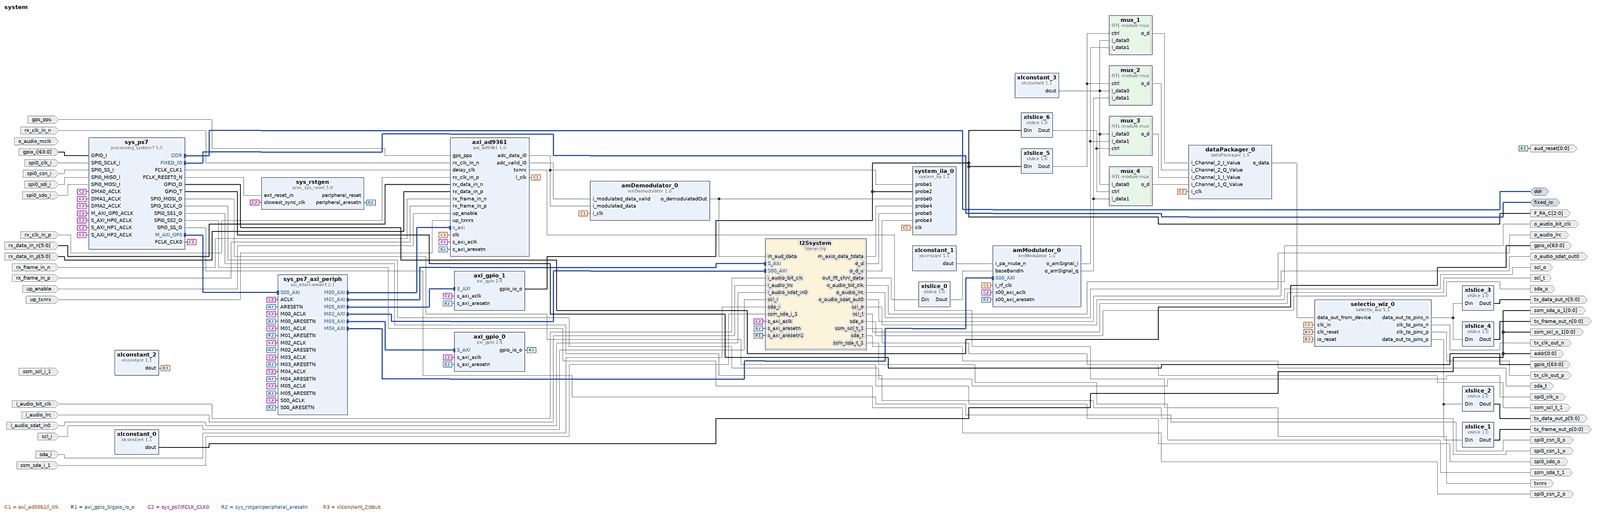
[diagram p0: block diagram of the top level, whole]
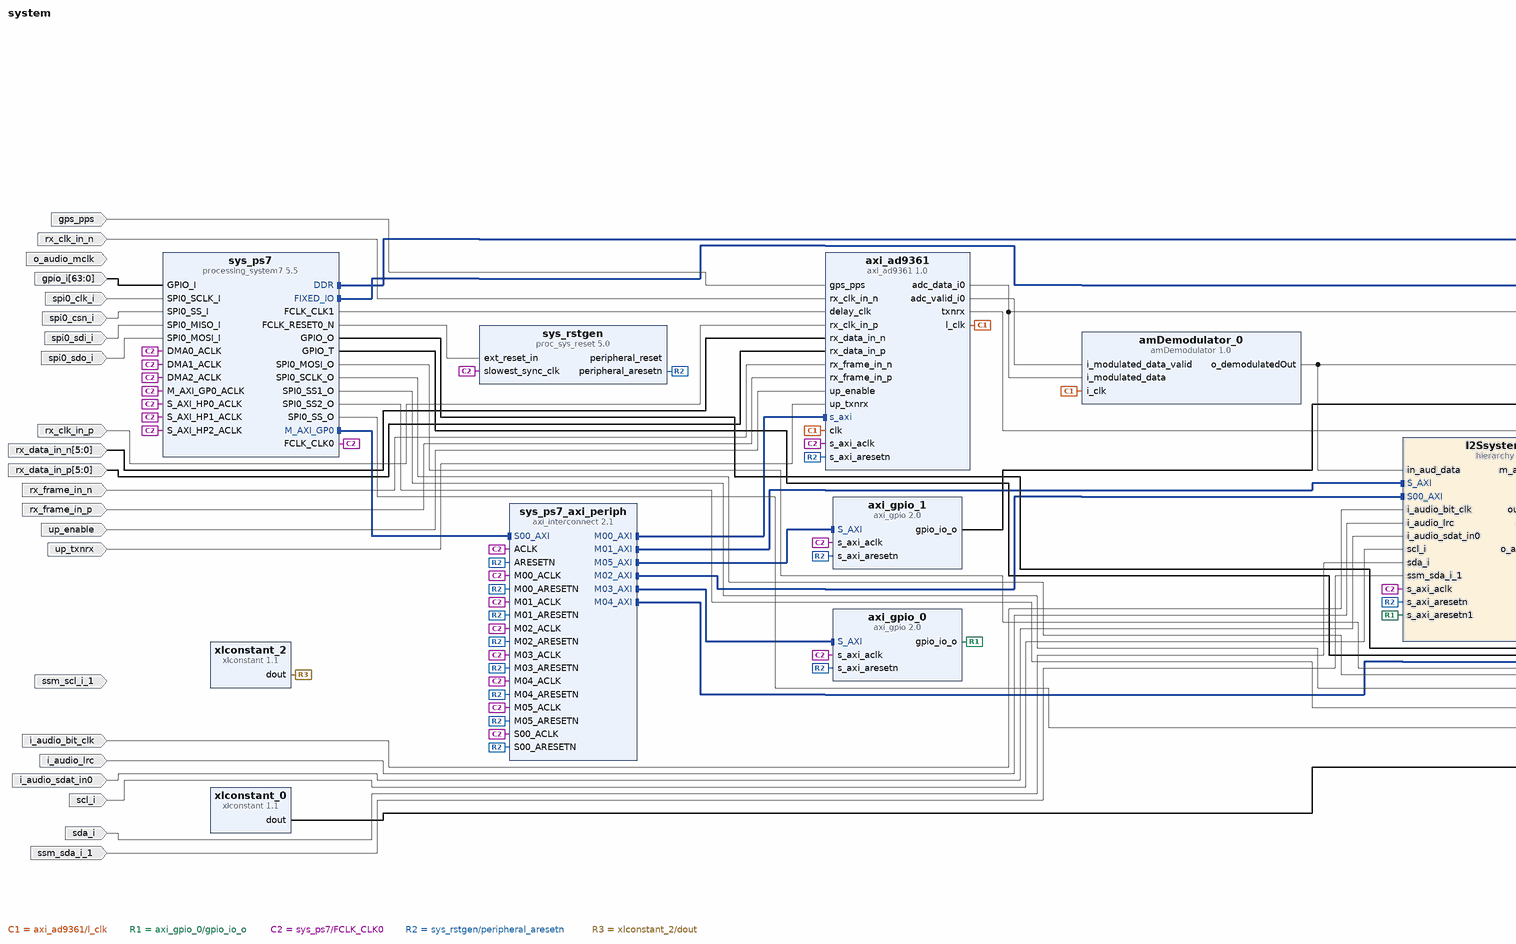
[diagram p1: block diagram of the top level, left part]
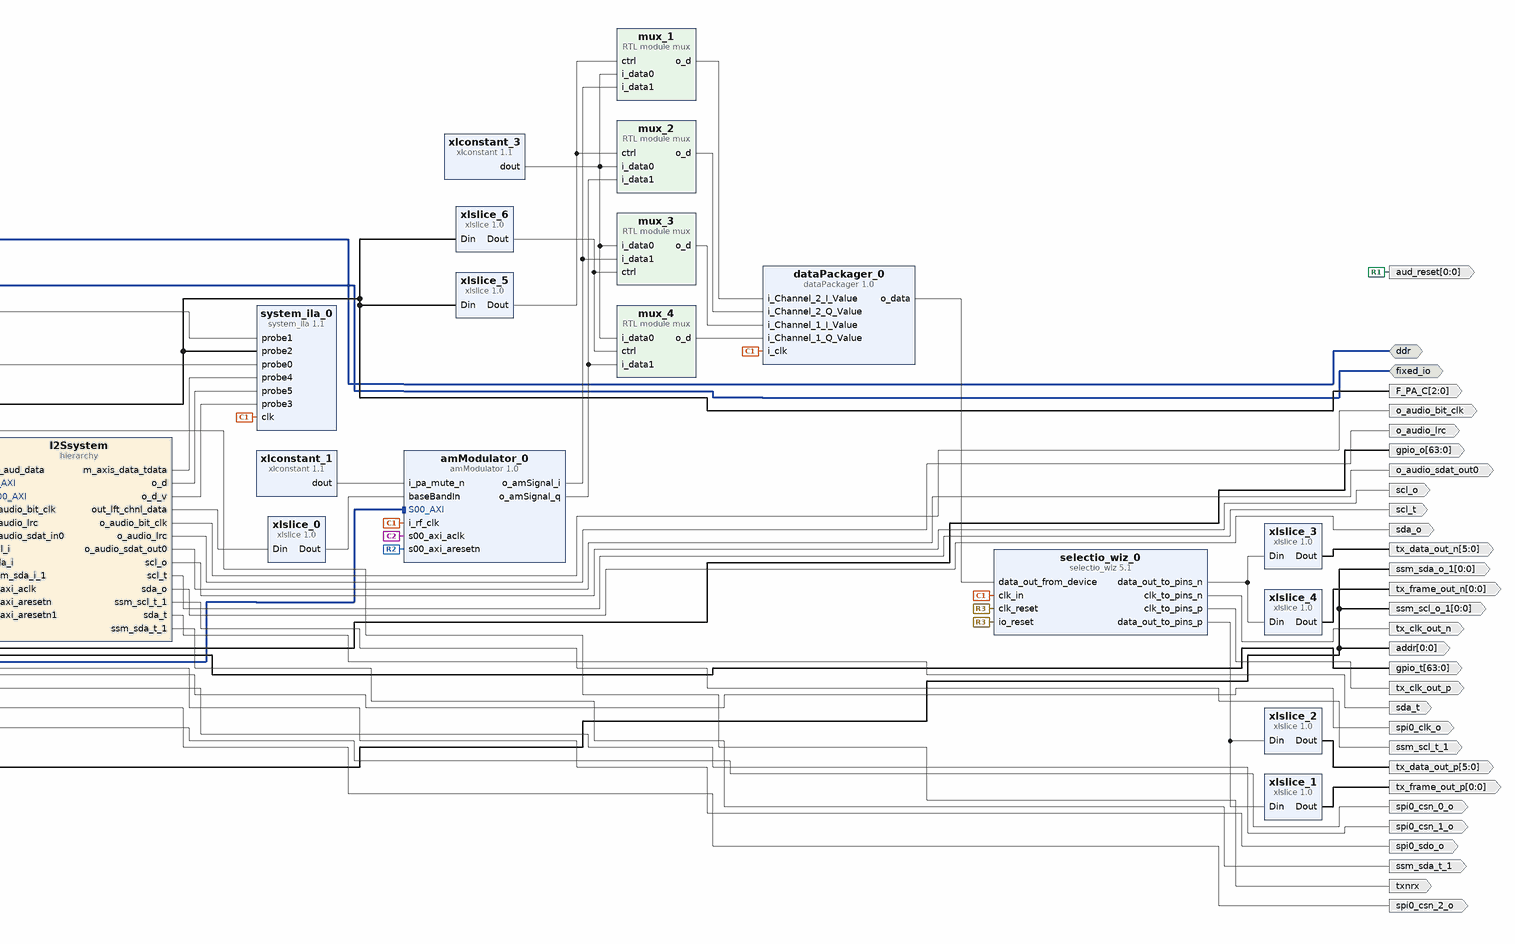
[diagram p2: block diagram of the top level, right part]
# Vivado block design system, xc7z030fbg484-2, Vivado 2021.1
create_bd_design system

create_bd_intf_port -mode Master -vlnv xilinx.com:interface:ddrx_rtl:1.0 ddr
create_bd_intf_port -mode Master -vlnv xilinx.com:display_processing_system7:fixedio_rtl:1.0 fixed_io
create_bd_port -dir O spi0_csn_2_o
create_bd_port -dir O spi0_csn_1_o
create_bd_port -dir O spi0_csn_0_o
create_bd_port -dir I spi0_csn_i
create_bd_port -dir I spi0_clk_i
create_bd_port -dir O spi0_clk_o
create_bd_port -dir I spi0_sdo_i
create_bd_port -dir O spi0_sdo_o
create_bd_port -dir I spi0_sdi_i
create_bd_port -dir I -from 63 -to 0 gpio_i
create_bd_port -dir O -from 63 -to 0 gpio_o
create_bd_port -dir O -from 63 -to 0 gpio_t
create_bd_port -dir O txnrx
create_bd_port -dir I up_enable
create_bd_port -dir I up_txnrx
create_bd_port -dir I gps_pps
create_bd_port -dir I rx_clk_in_p
create_bd_port -dir I rx_clk_in_n
create_bd_port -dir I rx_frame_in_p
create_bd_port -dir I rx_frame_in_n
create_bd_port -dir I -from 5 -to 0 rx_data_in_p
create_bd_port -dir I -from 5 -to 0 rx_data_in_n
create_bd_port -dir O tx_clk_out_p
create_bd_port -dir O tx_clk_out_n
create_bd_port -dir O -from 0 -to 0 tx_frame_out_p
create_bd_port -dir O -from 0 -to 0 tx_frame_out_n
create_bd_port -dir O -from 5 -to 0 tx_data_out_p
create_bd_port -dir O -from 5 -to 0 tx_data_out_n
create_bd_port -dir I scl_i
create_bd_port -dir O scl_o
create_bd_port -dir O scl_t
create_bd_port -dir I sda_i
create_bd_port -dir O sda_o
create_bd_port -dir O sda_t
create_bd_port -dir O -type clk ssm_scl_t_1
create_bd_port -dir O ssm_sda_t_1
create_bd_port -dir O -type clk o_audio_bit_clk
create_bd_port -dir O o_audio_lrc
create_bd_port -dir O o_audio_sdat_out0
create_bd_port -dir I i_audio_sdat_in0
create_bd_port -dir I i_audio_lrc
create_bd_port -dir I -type clk i_audio_bit_clk
set_property -dict {CONFIG.FREQ_HZ 100000000} [get_bd_ports i_audio_bit_clk]
create_bd_port -dir I ssm_sda_i_1
create_bd_port -dir O -from 0 -to 0 ssm_sda_o_1
create_bd_port -dir O -from 0 -to 0 ssm_scl_o_1
create_bd_port -dir O -from 0 -to 0 addr
create_bd_port -dir I o_audio_mclk
create_bd_port -dir I ssm_scl_i_1
create_bd_port -dir O -from 0 -to 0 aud_reset
create_bd_port -dir O -from 2 -to 0 F_PA_C

create_bd_cell -type ip -vlnv analog.com:user:axi_ad9361:1.0 axi_ad9361
set_property -dict [list \
  CONFIG.ADC_DATAFORMAT_DISABLE 0 \
  CONFIG.ADC_DATAPATH_DISABLE 0 \
  CONFIG.ADC_DCFILTER_DISABLE 0 \
  CONFIG.ADC_INIT_DELAY 29 \
  CONFIG.ADC_IQCORRECTION_DISABLE 0 \
  CONFIG.ADC_USERPORTS_DISABLE 0 \
  CONFIG.CMOS_OR_LVDS_N 0 \
  CONFIG.DAC_DATAPATH_DISABLE 0 \
  CONFIG.DAC_DDS_DISABLE 0 \
  CONFIG.DAC_IODELAY_ENABLE 1 \
  CONFIG.DAC_IQCORRECTION_DISABLE 0 \
  CONFIG.DAC_USERPORTS_DISABLE 0 \
  CONFIG.DEV_PACKAGE 4 \
  CONFIG.FPGA_FAMILY 4 \
  CONFIG.FPGA_TECHNOLOGY 1 \
  CONFIG.ID 0 \
  CONFIG.MODE_1R1T 0 \
  CONFIG.SPEED_GRADE 21 \
  CONFIG.TDD_DISABLE 0 \
] [get_bd_cells axi_ad9361]
create_bd_cell -type ip -vlnv xilinx.com:ip:processing_system7:5.5 sys_ps7
set_property -dict [list \
  CONFIG.PCW_APU_PERIPHERAL_FREQMHZ 666.666666 \
  CONFIG.PCW_CPU_CPU_6X4X_MAX_RANGE 800 \
  CONFIG.PCW_ENET0_PERIPHERAL_ENABLE 0 \
  CONFIG.PCW_ENET1_PERIPHERAL_CLKSRC External \
  CONFIG.PCW_EN_CLK1_PORT 1 \
  CONFIG.PCW_EN_CLK2_PORT 1 \
  CONFIG.PCW_EN_RST1_PORT 1 \
  CONFIG.PCW_EN_RST2_PORT 1 \
  CONFIG.PCW_FCLK_CLK1_BUF TRUE \
  CONFIG.PCW_FCLK_CLK2_BUF TRUE \
  CONFIG.PCW_FPGA0_PERIPHERAL_FREQMHZ 100.0 \
  CONFIG.PCW_FPGA1_PERIPHERAL_FREQMHZ 200.0 \
  CONFIG.PCW_FPGA2_PERIPHERAL_FREQMHZ 200.0 \
  CONFIG.PCW_FPGA_FCLK1_ENABLE 1 \
  CONFIG.PCW_FPGA_FCLK2_ENABLE 1 \
  CONFIG.PCW_GPIO_EMIO_GPIO_ENABLE 1 \
  CONFIG.PCW_GPIO_EMIO_GPIO_IO 64 \
  CONFIG.PCW_GPIO_MIO_GPIO_ENABLE 1 \
  CONFIG.PCW_GPIO_MIO_GPIO_IO MIO \
  CONFIG.PCW_I2C_RESET_ENABLE 0 \
  CONFIG.PCW_IRQ_F2P_INTR 1 \
  CONFIG.PCW_IRQ_F2P_MODE REVERSE \
  CONFIG.PCW_PERIPHERAL_BOARD_PRESET None \
  CONFIG.PCW_PRESET_BANK0_VOLTAGE {LVCMOS 1.8V} \
  CONFIG.PCW_PRESET_BANK1_VOLTAGE {LVCMOS 1.8V} \
  CONFIG.PCW_QSPI_GRP_SINGLE_SS_ENABLE 1 \
  CONFIG.PCW_QSPI_GRP_SINGLE_SS_IO {MIO 1 .. 6} \
  CONFIG.PCW_QSPI_PERIPHERAL_ENABLE 1 \
  CONFIG.PCW_QSPI_QSPI_IO {MIO 1 .. 6} \
  CONFIG.PCW_SD0_PERIPHERAL_ENABLE 0 \
  CONFIG.PCW_SINGLE_QSPI_DATA_MODE x4 \
  CONFIG.PCW_SPI0_PERIPHERAL_ENABLE 1 \
  CONFIG.PCW_SPI0_SPI0_IO EMIO \
  CONFIG.PCW_UART1_PERIPHERAL_ENABLE 0 \
  CONFIG.PCW_UIPARAM_DDR_BUS_WIDTH {16 Bit} \
  CONFIG.PCW_UIPARAM_DDR_FREQ_MHZ 533.333333 \
  CONFIG.PCW_UIPARAM_DDR_PARTNO {MT41K256M16 RE-125} \
  CONFIG.PCW_USB0_PERIPHERAL_ENABLE 0 \
  CONFIG.PCW_USB_RESET_ENABLE 0 \
  CONFIG.PCW_USE_DMA0 1 \
  CONFIG.PCW_USE_DMA1 1 \
  CONFIG.PCW_USE_DMA2 1 \
  CONFIG.PCW_USE_FABRIC_INTERRUPT 1 \
  CONFIG.PCW_USE_S_AXI_HP0 1 \
  CONFIG.PCW_USE_S_AXI_HP1 1 \
  CONFIG.PCW_USE_S_AXI_HP2 1 \
] [get_bd_cells sys_ps7]
# 498 more settings of sys_ps7 are not shown: defaults, MIO pin electricals, DDR timing, and values the tool derives
create_bd_cell -type ip -vlnv xilinx.com:ip:proc_sys_reset:5.0 sys_rstgen
set_property -dict {CONFIG.C_EXT_RST_WIDTH 1} [get_bd_cells sys_rstgen]
create_bd_cell -type ip -vlnv xilinx.com:ip:axi_interconnect:2.1 sys_ps7_axi_periph
set_property -dict {CONFIG.NUM_MI 6} [get_bd_cells sys_ps7_axi_periph]
create_bd_cell -type ip -vlnv xilinx.com:user:amDemodulator:1.0 amDemodulator_0
create_bd_cell -type hier I2Ssystem
create_bd_cell -type ip -vlnv xilinx.com:ip:xlconstant:1.1 xlconstant_0
set_property -dict {CONFIG.CONST_VAL 0} [get_bd_cells xlconstant_0]
create_bd_cell -type ip -vlnv xilinx.com:ip:axi_gpio:2.0 axi_gpio_0
set_property -dict {CONFIG.C_ALL_OUTPUTS 1 CONFIG.C_DOUT_DEFAULT 0x00000001 CONFIG.C_GPIO_WIDTH 1} [get_bd_cells axi_gpio_0]
create_bd_cell -type ip -vlnv xilinx.com:ip:xlconstant:1.1 xlconstant_1
create_bd_cell -type ip -vlnv xilinx.com:ip:xlslice:1.0 xlslice_0
set_property -dict {CONFIG.DIN_FROM 29 CONFIG.DIN_TO 18 CONFIG.DIN_WIDTH 31 CONFIG.DOUT_WIDTH 12} [get_bd_cells xlslice_0]
create_bd_cell -type ip -vlnv xilinx.com:user:amModulator:1.0 amModulator_0
create_bd_cell -type ip -vlnv xilinx.com:ip:selectio_wiz:5.1 selectio_wiz_0
set_property -dict [list \
  CONFIG.BUS_DIR OUTPUTS \
  CONFIG.BUS_IO_STD LVDS \
  CONFIG.BUS_SIG_TYPE DIFF \
  CONFIG.CLK_FWD true \
  CONFIG.CLK_FWD_IO_STD LVDS \
  CONFIG.CLK_FWD_SIG_TYPE DIFF \
  CONFIG.CONFIG_CLK_FWD true \
  CONFIG.SELIO_ACTIVE_EDGE DDR \
  CONFIG.SELIO_BUS_IN_DELAY NONE \
  CONFIG.SELIO_CLK_BUF MMCM \
  CONFIG.SELIO_CLK_IO_STD LVDS \
  CONFIG.SELIO_CLK_SIG_TYPE DIFF \
  CONFIG.SELIO_INTERFACE_TYPE NETWORKING \
  CONFIG.SERIALIZATION_FACTOR 4 \
  CONFIG.SYSTEM_DATA_WIDTH 7 \
] [get_bd_cells selectio_wiz_0]
create_bd_cell -type ip -vlnv xilinx.com:user:dataPackager:1.0 dataPackager_0
create_bd_cell -type ip -vlnv xilinx.com:ip:xlconstant:1.1 xlconstant_2
set_property -dict {CONFIG.CONST_VAL 0} [get_bd_cells xlconstant_2]
create_bd_cell -type ip -vlnv xilinx.com:ip:xlslice:1.0 xlslice_1
set_property -dict {CONFIG.DIN_WIDTH 7} [get_bd_cells xlslice_1]
create_bd_cell -type ip -vlnv xilinx.com:ip:xlslice:1.0 xlslice_2
set_property -dict {CONFIG.DIN_FROM 6 CONFIG.DIN_TO 1 CONFIG.DIN_WIDTH 7 CONFIG.DOUT_WIDTH 6} [get_bd_cells xlslice_2]
create_bd_cell -type ip -vlnv xilinx.com:ip:xlslice:1.0 xlslice_3
set_property -dict {CONFIG.DIN_FROM 6 CONFIG.DIN_TO 1 CONFIG.DIN_WIDTH 7 CONFIG.DOUT_WIDTH 6} [get_bd_cells xlslice_3]
create_bd_cell -type ip -vlnv xilinx.com:ip:xlslice:1.0 xlslice_4
set_property -dict {CONFIG.DIN_WIDTH 7} [get_bd_cells xlslice_4]
create_bd_cell -type ip -vlnv xilinx.com:ip:axi_gpio:2.0 axi_gpio_1
set_property -dict {CONFIG.C_ALL_OUTPUTS 1 CONFIG.C_DOUT_DEFAULT 0x00000007 CONFIG.C_GPIO_WIDTH 3} [get_bd_cells axi_gpio_1]
create_bd_cell -type module -reference mux mux_1
create_bd_cell -type module -reference mux mux_2
create_bd_cell -type module -reference mux mux_3
create_bd_cell -type module -reference mux mux_4
create_bd_cell -type ip -vlnv xilinx.com:ip:xlconstant:1.1 xlconstant_3
set_property -dict {CONFIG.CONST_VAL 0 CONFIG.CONST_WIDTH 12} [get_bd_cells xlconstant_3]
create_bd_cell -type ip -vlnv xilinx.com:ip:xlslice:1.0 xlslice_5
set_property -dict {CONFIG.DIN_FROM 2 CONFIG.DIN_TO 2 CONFIG.DIN_WIDTH 3 CONFIG.DOUT_WIDTH 1} [get_bd_cells xlslice_5]
create_bd_cell -type ip -vlnv xilinx.com:ip:xlslice:1.0 xlslice_6
set_property -dict {CONFIG.DIN_FROM 2 CONFIG.DIN_TO 2 CONFIG.DIN_WIDTH 3 CONFIG.DOUT_WIDTH 1} [get_bd_cells xlslice_6]
create_bd_cell -type ip -vlnv xilinx.com:ip:system_ila:1.1 system_ila_0
set_property -dict [list \
  CONFIG.C_DATA_DEPTH 65536 \
  CONFIG.C_MON_TYPE NATIVE \
  CONFIG.C_NUM_OF_PROBES 6 \
  CONFIG.C_PROBE0_TYPE 0 \
] [get_bd_cells system_ila_0]

# ---- hierarchy /I2Ssystem ----
current_bd_instance /I2Ssystem
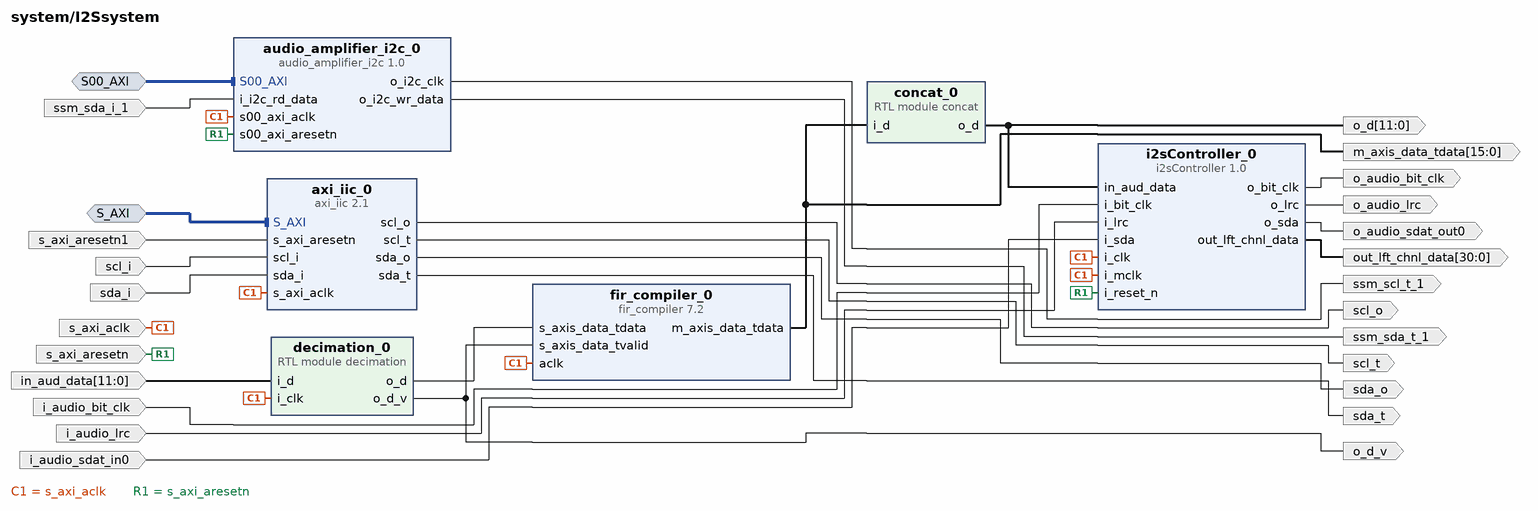
[diagram p3: block diagram inside /I2Ssystem]
create_bd_intf_pin -mode Slave -vlnv xilinx.com:interface:aximm_rtl:1.0 S_AXI
create_bd_intf_pin -mode Slave -vlnv xilinx.com:interface:aximm_rtl:1.0 S00_AXI
create_bd_pin -dir I -type clk s_axi_aclk
create_bd_pin -dir I -type rst s_axi_aresetn
create_bd_pin -dir I sda_i
create_bd_pin -dir O sda_o
create_bd_pin -dir O sda_t
create_bd_pin -dir I scl_i
create_bd_pin -dir O scl_o
create_bd_pin -dir O scl_t
create_bd_pin -dir O -type clk ssm_scl_t_1
create_bd_pin -dir O ssm_sda_t_1
create_bd_pin -dir O -type clk o_audio_bit_clk
create_bd_pin -dir O o_audio_lrc
create_bd_pin -dir O o_audio_sdat_out0
create_bd_pin -dir I i_audio_sdat_in0
create_bd_pin -dir I i_audio_lrc
create_bd_pin -dir I -type clk i_audio_bit_clk
create_bd_pin -dir I ssm_sda_i_1
create_bd_pin -dir I -from 11 -to 0 in_aud_data
create_bd_pin -dir I -type rst s_axi_aresetn1
create_bd_pin -dir O -from 30 -to 0 out_lft_chnl_data
create_bd_pin -dir O o_d_v
create_bd_pin -dir O -from 15 -to 0 m_axis_data_tdata
create_bd_pin -dir O -from 11 -to 0 o_d

create_bd_cell -type ip -vlnv xilinx.com:ip:axi_iic:2.1 axi_iic_0
create_bd_cell -type ip -vlnv xilinx.com:user:i2sController:1.0 i2sController_0
create_bd_cell -type ip -vlnv xilinx.com:user:audio_amplifier_i2c:1.0 audio_amplifier_i2c_0
create_bd_cell -type ip -vlnv xilinx.com:ip:fir_compiler:7.2 fir_compiler_0
set_property -dict [list \
  CONFIG.BestPrecision true \
  CONFIG.Clock_Frequency 100 \
  CONFIG.CoefficientVector 4.97857463989629e-05,-9.66186716768311e-05,-0.000285972693276480,-0.000638033059764221,-0.00118922643832491,-0.00196250311844038,-0.00295189527080732,-0.00411069959506877,-0.00534467765861517,-0.00651246591908960,-0.00743545387545380,-0.00791730638070645,-0.00777252485882118,-0.00686079086122265,-0.00512249591113992,-0.00260870103501410,0.000500343769484166,0.00389440724056693,0.00715402352601513,0.00979395431763195,0.0113255078683568,0.0113327722797372,0.00955141668320275,0.00593840384848782,0.000720974159454840,-0.00558741726177260,-0.0122098462375855,-0.0181706817624835,-0.0223972169879857,-0.0238486887587461,-0.0216567072141399,-0.0152586643030505,-0.00450455913284762,0.0102798010092384,0.0282855411136966,0.0482744206888967,0.0686901496345555,0.0878159846963768,0.103959968995451,0.115644736336165,0.121777428841651,0.121777428841651,0.115644736336165,0.103959968995451,0.0878159846963768,0.0686901496345555,0.0482744206888967,0.0282855411136966,0.0102798010092384,-0.00450455913284762,-0.0152586643030505,-0.0216567072141399,-0.0238486887587461,-0.0223972169879857,-0.0181706817624835,-0.0122098462375855,-0.00558741726177260,0.000720974159454840,0.00593840384848782,0.00955141668320275,0.0113327722797372,0.0113255078683568,0.00979395431763195,0.00715402352601513,0.00389440724056693,0.000500343769484166,-0.00260870103501410,-0.00512249591113992,-0.00686079086122265,-0.00777252485882118,-0.00791730638070645,-0.00743545387545380,-0.00651246591908960,-0.00534467765861517,-0.00411069959506877,-0.00295189527080732,-0.00196250311844038,-0.00118922643832491,-0.000638033059764221,-0.000285972693276480,-9.66186716768311e-05,4.97857463989629e-05 \
  CONFIG.Coefficient_Fractional_Bits 18 \
  CONFIG.Coefficient_Sets 1 \
  CONFIG.Coefficient_Sign Signed \
  CONFIG.Coefficient_Structure Inferred \
  CONFIG.Coefficient_Width 16 \
  CONFIG.ColumnConfig 1 \
  CONFIG.Data_Fractional_Bits 11 \
  CONFIG.Data_Sign Signed \
  CONFIG.Data_Width 12 \
  CONFIG.Filter_Architecture Systolic_Multiply_Accumulate \
  CONFIG.Output_Rounding_Mode Truncate_LSBs \
  CONFIG.Output_Width 12 \
  CONFIG.Quantization Quantize_Only \
  CONFIG.Sample_Frequency 0.096 \
] [get_bd_cells fir_compiler_0]
create_bd_cell -type module -reference decimation decimation_0
create_bd_cell -type module -reference concat concat_0

# ---- connections ----

current_bd_instance /I2Ssystem
connect_bd_intf_net [get_bd_intf_pins S00_AXI] [get_bd_intf_pins audio_amplifier_i2c_0/S00_AXI]
connect_bd_intf_net [get_bd_intf_pins S_AXI] [get_bd_intf_pins axi_iic_0/S_AXI]
connect_bd_net [get_bd_pins audio_amplifier_i2c_0/o_i2c_clk] [get_bd_pins ssm_scl_t_1]
connect_bd_net [get_bd_pins audio_amplifier_i2c_0/o_i2c_wr_data] [get_bd_pins ssm_sda_t_1]
connect_bd_net [get_bd_pins axi_iic_0/scl_o] [get_bd_pins scl_o]
connect_bd_net [get_bd_pins axi_iic_0/scl_t] [get_bd_pins scl_t]
connect_bd_net [get_bd_pins axi_iic_0/sda_o] [get_bd_pins sda_o]
connect_bd_net [get_bd_pins axi_iic_0/sda_t] [get_bd_pins sda_t]
connect_bd_net [get_bd_pins concat_0/o_d] [get_bd_pins i2sController_0/in_aud_data] [get_bd_pins o_d]
connect_bd_net [get_bd_pins decimation_0/o_d] [get_bd_pins fir_compiler_0/s_axis_data_tdata]
connect_bd_net [get_bd_pins decimation_0/o_d_v] [get_bd_pins fir_compiler_0/s_axis_data_tvalid] [get_bd_pins o_d_v]
connect_bd_net [get_bd_pins fir_compiler_0/m_axis_data_tdata] [get_bd_pins m_axis_data_tdata] [get_bd_pins concat_0/i_d]
connect_bd_net [get_bd_pins i2sController_0/o_bit_clk] [get_bd_pins o_audio_bit_clk]
connect_bd_net [get_bd_pins i2sController_0/o_lrc] [get_bd_pins o_audio_lrc]
connect_bd_net [get_bd_pins i2sController_0/o_sda] [get_bd_pins o_audio_sdat_out0]
connect_bd_net [get_bd_pins i2sController_0/out_lft_chnl_data] [get_bd_pins out_lft_chnl_data]
connect_bd_net [get_bd_pins i_audio_bit_clk] [get_bd_pins i2sController_0/i_bit_clk]
connect_bd_net [get_bd_pins i_audio_lrc] [get_bd_pins i2sController_0/i_lrc]
connect_bd_net -net i_audio_sdat_in0_1 [get_bd_pins i_audio_sdat_in0] [get_bd_pins i2sController_0/i_sda]
connect_bd_net -net in_aud_data_1 [get_bd_pins in_aud_data] [get_bd_pins decimation_0/i_d]
connect_bd_net -net s_axi_aresetn1_1 [get_bd_pins s_axi_aresetn1] [get_bd_pins axi_iic_0/s_axi_aresetn]
connect_bd_net [get_bd_pins scl_i] [get_bd_pins axi_iic_0/scl_i]
connect_bd_net [get_bd_pins sda_i] [get_bd_pins axi_iic_0/sda_i]
connect_bd_net -net ssm_sda_i_1_1 [get_bd_pins ssm_sda_i_1] [get_bd_pins audio_amplifier_i2c_0/i_i2c_rd_data]
connect_bd_net -net sys_cpu_clk [get_bd_pins s_axi_aclk] \
  [get_bd_pins axi_iic_0/s_axi_aclk] [get_bd_pins audio_amplifier_i2c_0/s00_axi_aclk] [get_bd_pins i2sController_0/i_clk] \
  [get_bd_pins fir_compiler_0/aclk] [get_bd_pins i2sController_0/i_mclk] [get_bd_pins decimation_0/i_clk]
connect_bd_net -net sys_cpu_resetn [get_bd_pins s_axi_aresetn] \
  [get_bd_pins audio_amplifier_i2c_0/s00_axi_aresetn] [get_bd_pins i2sController_0/i_reset_n]
set_property HDL_ATTRIBUTE.DEBUG true [get_bd_nets in_aud_data_1]

current_bd_instance /
connect_bd_intf_net [get_bd_intf_ports ddr] [get_bd_intf_pins sys_ps7/DDR]
connect_bd_intf_net [get_bd_intf_ports fixed_io] [get_bd_intf_pins sys_ps7/FIXED_IO]
connect_bd_intf_net [get_bd_intf_pins sys_ps7/M_AXI_GP0] [get_bd_intf_pins sys_ps7_axi_periph/S00_AXI]
connect_bd_intf_net [get_bd_intf_pins sys_ps7_axi_periph/M00_AXI] [get_bd_intf_pins axi_ad9361/s_axi]
connect_bd_intf_net [get_bd_intf_pins sys_ps7_axi_periph/M01_AXI] [get_bd_intf_pins I2Ssystem/S_AXI]
connect_bd_intf_net [get_bd_intf_pins sys_ps7_axi_periph/M02_AXI] [get_bd_intf_pins I2Ssystem/S00_AXI]
connect_bd_intf_net [get_bd_intf_pins sys_ps7_axi_periph/M03_AXI] [get_bd_intf_pins axi_gpio_0/S_AXI]
connect_bd_intf_net [get_bd_intf_pins sys_ps7_axi_periph/M04_AXI] [get_bd_intf_pins amModulator_0/S00_AXI]
connect_bd_intf_net [get_bd_intf_pins sys_ps7_axi_periph/M05_AXI] [get_bd_intf_pins axi_gpio_1/S_AXI]
connect_bd_net [get_bd_pins I2Ssystem/m_axis_data_tdata] [get_bd_pins system_ila_0/probe4]
connect_bd_net [get_bd_pins I2Ssystem/o_audio_bit_clk] [get_bd_ports o_audio_bit_clk]
connect_bd_net [get_bd_pins I2Ssystem/o_audio_lrc] [get_bd_ports o_audio_lrc]
connect_bd_net [get_bd_pins I2Ssystem/o_audio_sdat_out0] [get_bd_ports o_audio_sdat_out0]
connect_bd_net [get_bd_pins I2Ssystem/o_d] [get_bd_pins system_ila_0/probe5]
connect_bd_net [get_bd_pins I2Ssystem/o_d_v] [get_bd_pins system_ila_0/probe3]
connect_bd_net [get_bd_pins I2Ssystem/out_lft_chnl_data] [get_bd_pins xlslice_0/Din]
connect_bd_net [get_bd_pins I2Ssystem/ssm_scl_t_1] [get_bd_ports ssm_scl_t_1]
connect_bd_net [get_bd_pins I2Ssystem/ssm_sda_t_1] [get_bd_ports ssm_sda_t_1]
connect_bd_net -net amDemodulator_0_o_demodulatedOut [get_bd_pins amDemodulator_0/o_demodulatedOut] \
  [get_bd_pins I2Ssystem/in_aud_data] [get_bd_pins system_ila_0/probe0]
connect_bd_net [get_bd_pins amModulator_0/o_amSignal_i] [get_bd_pins mux_1/i_data1] [get_bd_pins mux_3/i_data1]
connect_bd_net [get_bd_pins amModulator_0/o_amSignal_q] [get_bd_pins mux_2/i_data1] [get_bd_pins mux_4/i_data1]
connect_bd_net -net axi_ad9361_adc_data_i0 [get_bd_pins axi_ad9361/adc_data_i0] \
  [get_bd_pins amDemodulator_0/i_modulated_data] [get_bd_pins system_ila_0/probe1]
connect_bd_net [get_bd_pins axi_ad9361/adc_valid_i0] [get_bd_pins amDemodulator_0/i_modulated_data_valid]
connect_bd_net [get_bd_pins axi_ad9361/l_clk] \
  [get_bd_pins axi_ad9361/clk] [get_bd_pins amDemodulator_0/i_clk] [get_bd_pins amModulator_0/i_rf_clk] \
  [get_bd_pins dataPackager_0/i_clk] [get_bd_pins selectio_wiz_0/clk_in] [get_bd_pins system_ila_0/clk]
connect_bd_net [get_bd_pins axi_ad9361/txnrx] [get_bd_ports txnrx]
connect_bd_net [get_bd_pins axi_gpio_0/gpio_io_o] [get_bd_ports aud_reset] [get_bd_pins I2Ssystem/s_axi_aresetn1]
connect_bd_net [get_bd_pins axi_gpio_1/gpio_io_o] \
  [get_bd_ports F_PA_C] [get_bd_pins xlslice_5/Din] [get_bd_pins xlslice_6/Din] [get_bd_pins system_ila_0/probe2]
connect_bd_net -net axi_iic_0_scl_o [get_bd_pins I2Ssystem/scl_o] [get_bd_ports scl_o]
connect_bd_net -net axi_iic_0_scl_t [get_bd_pins I2Ssystem/scl_t] [get_bd_ports scl_t]
connect_bd_net -net axi_iic_0_sda_o [get_bd_pins I2Ssystem/sda_o] [get_bd_ports sda_o]
connect_bd_net -net axi_iic_0_sda_t [get_bd_pins I2Ssystem/sda_t] [get_bd_ports sda_t]
connect_bd_net [get_bd_pins dataPackager_0/o_data] [get_bd_pins selectio_wiz_0/data_out_from_device]
connect_bd_net [get_bd_ports gpio_i] [get_bd_pins sys_ps7/GPIO_I]
connect_bd_net [get_bd_ports gps_pps] [get_bd_pins axi_ad9361/gps_pps]
connect_bd_net [get_bd_ports i_audio_bit_clk] [get_bd_pins I2Ssystem/i_audio_bit_clk]
connect_bd_net [get_bd_ports i_audio_lrc] [get_bd_pins I2Ssystem/i_audio_lrc]
connect_bd_net -net i_audio_sdat_in0_1 [get_bd_ports i_audio_sdat_in0] [get_bd_pins I2Ssystem/i_audio_sdat_in0]
connect_bd_net [get_bd_pins mux_1/o_d] [get_bd_pins dataPackager_0/i_Channel_2_I_Value]
connect_bd_net [get_bd_pins mux_2/o_d] [get_bd_pins dataPackager_0/i_Channel_2_Q_Value]
connect_bd_net [get_bd_pins mux_3/o_d] [get_bd_pins dataPackager_0/i_Channel_1_I_Value]
connect_bd_net [get_bd_pins mux_4/o_d] [get_bd_pins dataPackager_0/i_Channel_1_Q_Value]
connect_bd_net [get_bd_ports rx_clk_in_n] [get_bd_pins axi_ad9361/rx_clk_in_n]
connect_bd_net [get_bd_ports rx_clk_in_p] [get_bd_pins axi_ad9361/rx_clk_in_p]
connect_bd_net [get_bd_ports rx_data_in_n] [get_bd_pins axi_ad9361/rx_data_in_n]
connect_bd_net [get_bd_ports rx_data_in_p] [get_bd_pins axi_ad9361/rx_data_in_p]
connect_bd_net [get_bd_ports rx_frame_in_n] [get_bd_pins axi_ad9361/rx_frame_in_n]
connect_bd_net [get_bd_ports rx_frame_in_p] [get_bd_pins axi_ad9361/rx_frame_in_p]
connect_bd_net [get_bd_ports scl_i] [get_bd_pins I2Ssystem/scl_i]
connect_bd_net [get_bd_ports sda_i] [get_bd_pins I2Ssystem/sda_i]
connect_bd_net [get_bd_pins selectio_wiz_0/clk_to_pins_n] [get_bd_ports tx_clk_out_n]
connect_bd_net [get_bd_pins selectio_wiz_0/clk_to_pins_p] [get_bd_ports tx_clk_out_p]
connect_bd_net [get_bd_pins selectio_wiz_0/data_out_to_pins_n] [get_bd_pins xlslice_3/Din] [get_bd_pins xlslice_4/Din]
connect_bd_net [get_bd_pins selectio_wiz_0/data_out_to_pins_p] [get_bd_pins xlslice_1/Din] [get_bd_pins xlslice_2/Din]
connect_bd_net [get_bd_ports spi0_clk_i] [get_bd_pins sys_ps7/SPI0_SCLK_I]
connect_bd_net [get_bd_ports spi0_csn_i] [get_bd_pins sys_ps7/SPI0_SS_I]
connect_bd_net [get_bd_ports spi0_sdi_i] [get_bd_pins sys_ps7/SPI0_MISO_I]
connect_bd_net [get_bd_ports spi0_sdo_i] [get_bd_pins sys_ps7/SPI0_MOSI_I]
connect_bd_net -net ssm_sda_i_1_1 [get_bd_ports ssm_sda_i_1] [get_bd_pins I2Ssystem/ssm_sda_i_1]
connect_bd_net -net sys_200m_clk [get_bd_pins sys_ps7/FCLK_CLK1] [get_bd_pins axi_ad9361/delay_clk]
connect_bd_net -net sys_cpu_clk [get_bd_pins sys_ps7/FCLK_CLK0] \
  [get_bd_pins axi_ad9361/s_axi_aclk] [get_bd_pins sys_ps7/M_AXI_GP0_ACLK] [get_bd_pins sys_ps7/S_AXI_HP0_ACLK] \
  [get_bd_pins sys_ps7/S_AXI_HP1_ACLK] [get_bd_pins sys_ps7/S_AXI_HP2_ACLK] [get_bd_pins sys_ps7/DMA0_ACLK] \
  [get_bd_pins sys_ps7/DMA1_ACLK] [get_bd_pins sys_ps7/DMA2_ACLK] [get_bd_pins sys_rstgen/slowest_sync_clk] \
  [get_bd_pins sys_ps7_axi_periph/ACLK] [get_bd_pins sys_ps7_axi_periph/S00_ACLK] [get_bd_pins sys_ps7_axi_periph/M00_ACLK] \
  [get_bd_pins sys_ps7_axi_periph/M01_ACLK] [get_bd_pins I2Ssystem/s_axi_aclk] [get_bd_pins sys_ps7_axi_periph/M02_ACLK] \
  [get_bd_pins axi_gpio_0/s_axi_aclk] [get_bd_pins sys_ps7_axi_periph/M03_ACLK] [get_bd_pins sys_ps7_axi_periph/M04_ACLK] \
  [get_bd_pins amModulator_0/s00_axi_aclk] [get_bd_pins axi_gpio_1/s_axi_aclk] [get_bd_pins sys_ps7_axi_periph/M05_ACLK]
# net sys_cpu_reset has one end: sys_rstgen/peripheral_reset
connect_bd_net -net sys_cpu_resetn [get_bd_pins sys_rstgen/peripheral_aresetn] \
  [get_bd_pins axi_ad9361/s_axi_aresetn] [get_bd_pins sys_ps7_axi_periph/S00_ARESETN] \
  [get_bd_pins sys_ps7_axi_periph/M00_ARESETN] [get_bd_pins sys_ps7_axi_periph/ARESETN] \
  [get_bd_pins sys_ps7_axi_periph/M01_ARESETN] [get_bd_pins I2Ssystem/s_axi_aresetn] \
  [get_bd_pins sys_ps7_axi_periph/M02_ARESETN] [get_bd_pins axi_gpio_0/s_axi_aresetn] \
  [get_bd_pins sys_ps7_axi_periph/M03_ARESETN] [get_bd_pins sys_ps7_axi_periph/M04_ARESETN] \
  [get_bd_pins amModulator_0/s00_axi_aresetn] [get_bd_pins axi_gpio_1/s_axi_aresetn] \
  [get_bd_pins sys_ps7_axi_periph/M05_ARESETN]
connect_bd_net [get_bd_pins sys_ps7/FCLK_RESET0_N] [get_bd_pins sys_rstgen/ext_reset_in]
connect_bd_net [get_bd_pins sys_ps7/GPIO_O] [get_bd_ports gpio_o]
connect_bd_net [get_bd_pins sys_ps7/GPIO_T] [get_bd_ports gpio_t]
connect_bd_net [get_bd_pins sys_ps7/SPI0_MOSI_O] [get_bd_ports spi0_sdo_o]
connect_bd_net [get_bd_pins sys_ps7/SPI0_SCLK_O] [get_bd_ports spi0_clk_o]
connect_bd_net [get_bd_pins sys_ps7/SPI0_SS1_O] [get_bd_ports spi0_csn_1_o]
connect_bd_net [get_bd_pins sys_ps7/SPI0_SS2_O] [get_bd_ports spi0_csn_2_o]
connect_bd_net [get_bd_pins sys_ps7/SPI0_SS_O] [get_bd_ports spi0_csn_0_o]
connect_bd_net [get_bd_ports up_enable] [get_bd_pins axi_ad9361/up_enable]
connect_bd_net [get_bd_ports up_txnrx] [get_bd_pins axi_ad9361/up_txnrx]
connect_bd_net [get_bd_pins xlconstant_0/dout] [get_bd_ports ssm_sda_o_1] [get_bd_ports ssm_scl_o_1] [get_bd_ports addr]
connect_bd_net [get_bd_pins xlconstant_1/dout] [get_bd_pins amModulator_0/i_pa_mute_n]
connect_bd_net [get_bd_pins xlconstant_2/dout] [get_bd_pins selectio_wiz_0/io_reset] [get_bd_pins selectio_wiz_0/clk_reset]
connect_bd_net [get_bd_pins xlconstant_3/dout] \
  [get_bd_pins mux_1/i_data0] [get_bd_pins mux_2/i_data0] [get_bd_pins mux_3/i_data0] [get_bd_pins mux_4/i_data0]
connect_bd_net [get_bd_pins xlslice_0/Dout] [get_bd_pins amModulator_0/baseBandIn]
connect_bd_net [get_bd_pins xlslice_1/Dout] [get_bd_ports tx_frame_out_p]
connect_bd_net [get_bd_pins xlslice_2/Dout] [get_bd_ports tx_data_out_p]
connect_bd_net [get_bd_pins xlslice_3/Dout] [get_bd_ports tx_data_out_n]
connect_bd_net [get_bd_pins xlslice_4/Dout] [get_bd_ports tx_frame_out_n]
connect_bd_net [get_bd_pins xlslice_5/Dout] [get_bd_pins mux_1/ctrl] [get_bd_pins mux_2/ctrl]
connect_bd_net [get_bd_pins xlslice_6/Dout] [get_bd_pins mux_3/ctrl] [get_bd_pins mux_4/ctrl]
set_property HDL_ATTRIBUTE.DEBUG true [get_bd_nets amDemodulator_0_o_demodulatedOut]
set_property HDL_ATTRIBUTE.MARK_DEBUG true [get_bd_nets amDemodulator_0_o_demodulatedOut]
set_property HDL_ATTRIBUTE.DEBUG true [get_bd_nets axi_ad9361_adc_data_i0]
set_property HDL_ATTRIBUTE.MARK_DEBUG true [get_bd_nets axi_ad9361_adc_data_i0]

# ---- address map ----
assign_bd_address -offset 0x41200000 -range 64K -target_address_space [get_bd_addr_spaces sys_ps7/Data] [get_bd_addr_segs axi_gpio_0/S_AXI/Reg]
assign_bd_address -offset 0x41210000 -range 64K -target_address_space [get_bd_addr_spaces sys_ps7/Data] [get_bd_addr_segs axi_gpio_1/S_AXI/Reg]
assign_bd_address -offset 0x41600000 -range 64K -target_address_space [get_bd_addr_spaces sys_ps7/Data] [get_bd_addr_segs I2Ssystem/axi_iic_0/S_AXI/Reg]
assign_bd_address -offset 0x43C00000 -range 64K -target_address_space [get_bd_addr_spaces sys_ps7/Data] [get_bd_addr_segs I2Ssystem/audio_amplifier_i2c_0/S00_AXI/S00_AXI_reg]
assign_bd_address -offset 0x43C10000 -range 64K -target_address_space [get_bd_addr_spaces sys_ps7/Data] [get_bd_addr_segs amModulator_0/S00_AXI/S00_AXI_reg]
assign_bd_address -offset 0x79020000 -range 64K -target_address_space [get_bd_addr_spaces sys_ps7/Data] [get_bd_addr_segs axi_ad9361/s_axi/axi_lite]

validate_bd_design
save_bd_design
